# Altium schematic sheet Digital Circuit.SchDoc
size A3
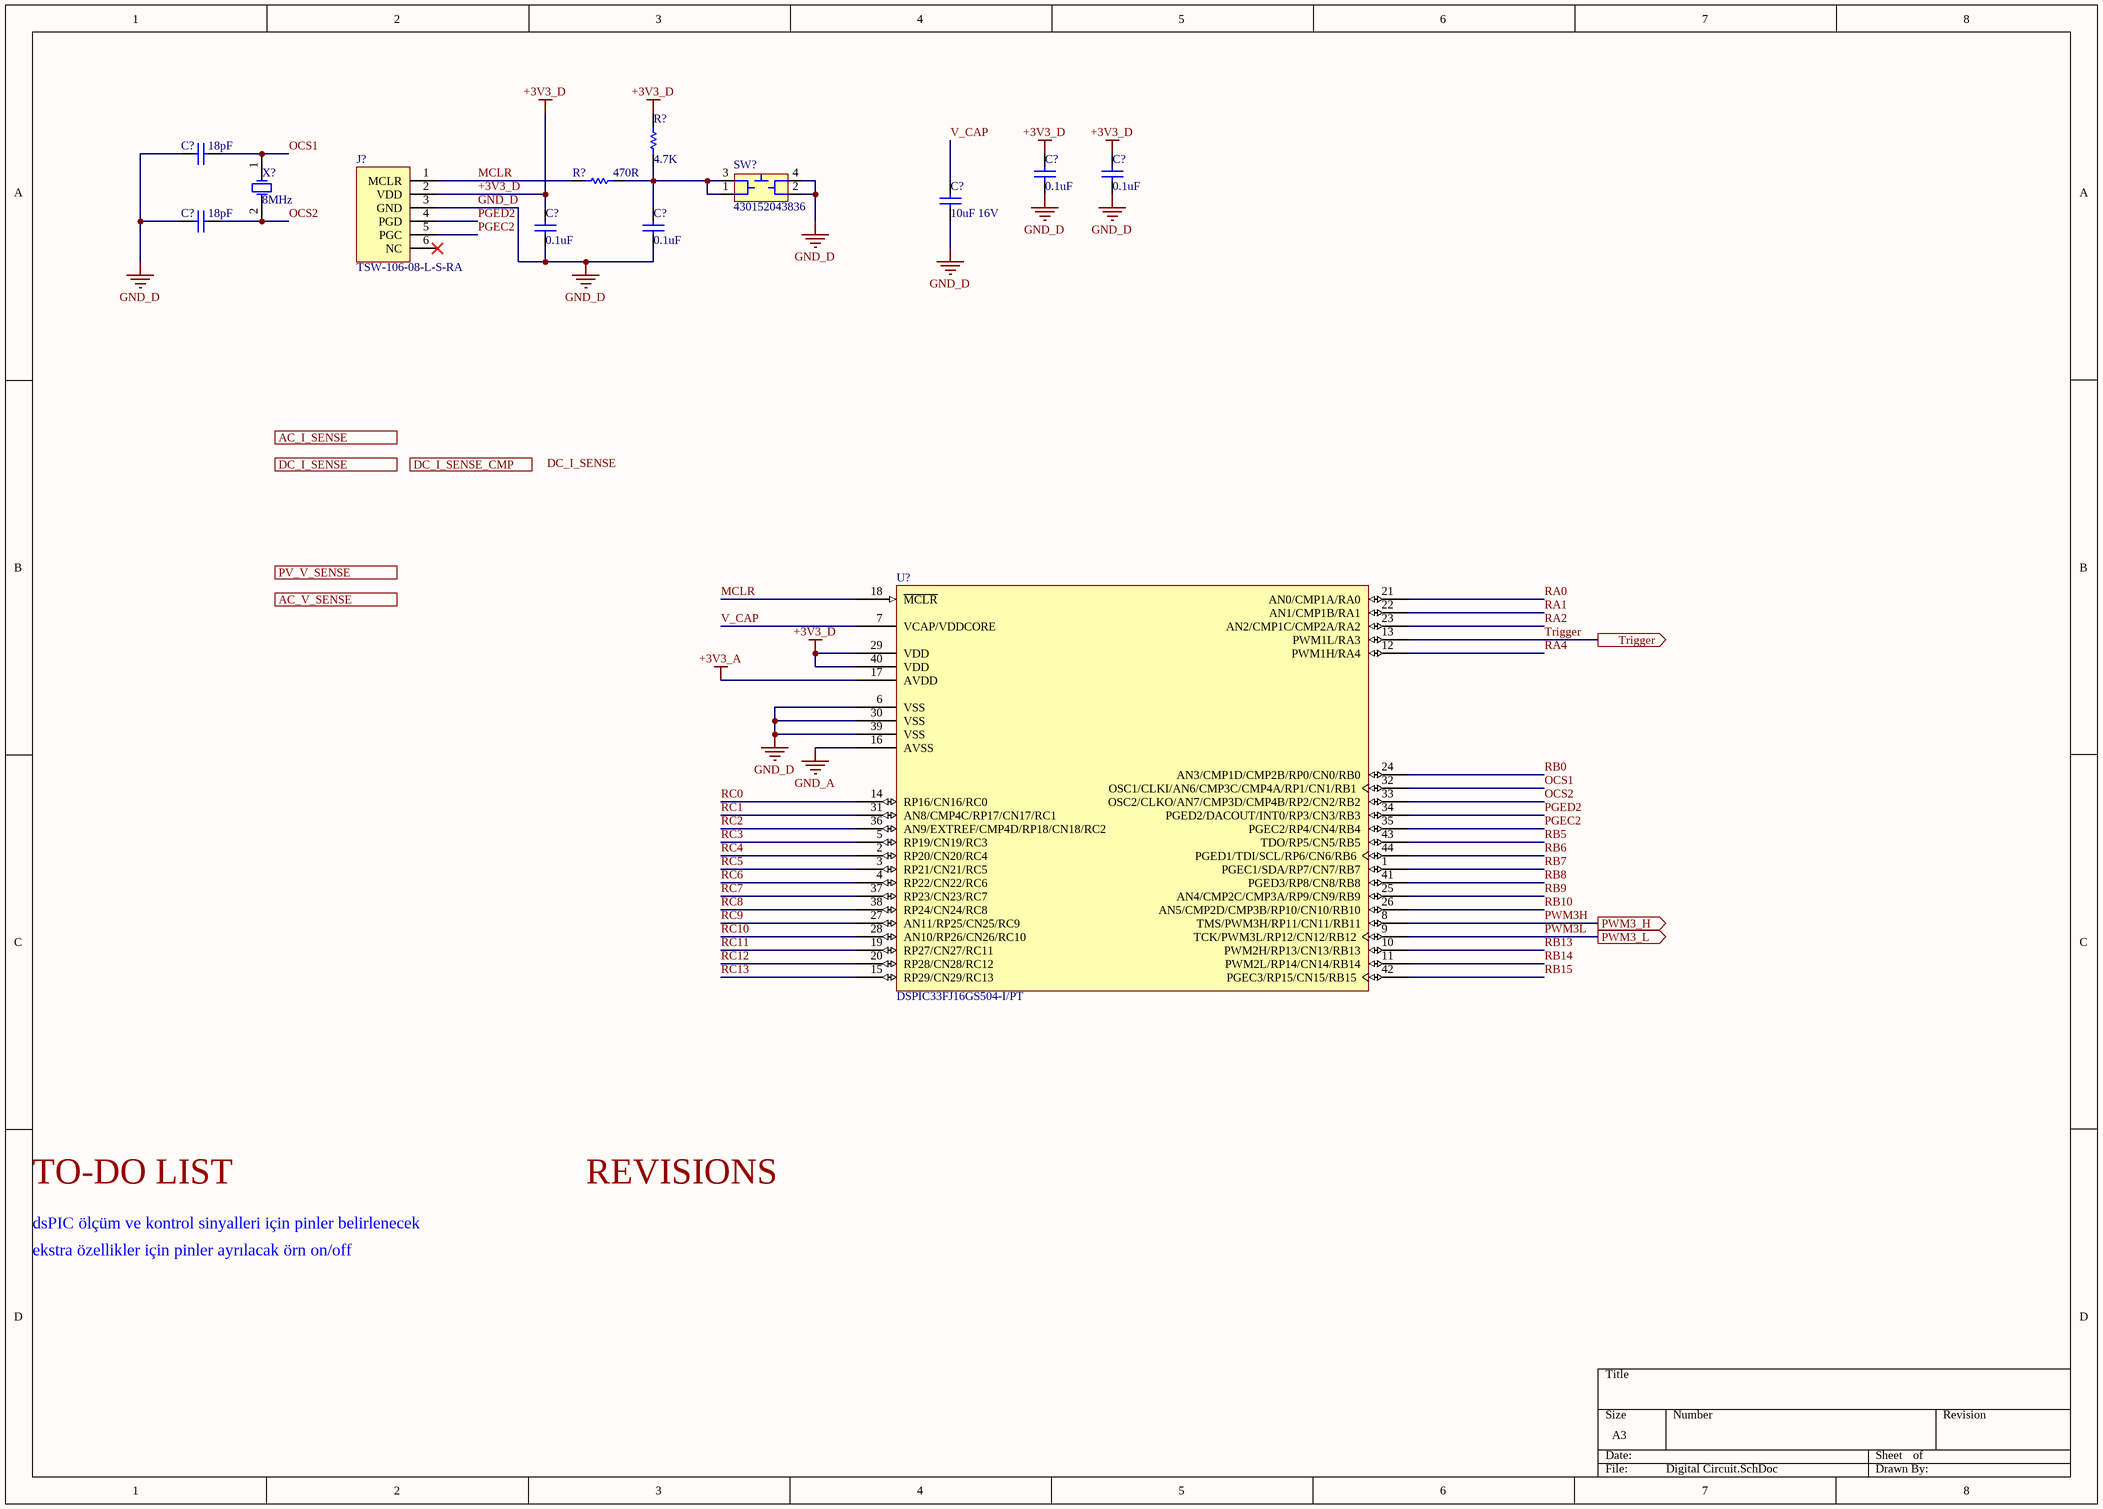
[diagram p0: Digital Circuit.SchDoc]

## Parts
(Parts that share a designator on the sheet are numbered #1, #2 ... from top to bottom, then left to right.)
C?#1  18pF  [1206 CAPACITOR]
C?#2  0.1uF  [1206 CAPACITOR]
C?#3  0.1uF  [1206 CAPACITOR]
C?#4  10uF 16V  [1206 CAPACITOR]
C?#5  18pF  [1206 CAPACITOR]
C?#6  0.1uF  [1206 CAPACITOR]
C?#7  0.1uF  [1206 CAPACITOR]
J?  TSW-106-08-L-S-RA  [1x6 Header 2.54mm]
R?#1  4.7K  [1206 Resistor Footprint]
R?#2  470R  [1206 Resistor Footprint]
SW?  430152043836  [6x6mm Button]
U?  DSPIC33FJ16GS504-I/PT  [dsPIC33F16GS504 Connector]
X?  8MHz  [HC-49/US Crystal Footprint]

## Ports
AC_I_SENSE (in), AC_V_SENSE (in), DC_I_SENSE (in), DC_I_SENSE_CMP (in), PV_V_SENSE (in), PWM3_H (out), PWM3_L (out), Trigger (out)

## Nets
+3V3_A: U?.17(AVDD)
+3V3_D: C?#2.2 C?#3.2 C?#6.2 J?.2(VDD) R?#1.2 U?.29(VDD) U?.40(VDD)
GND_A: U?.16(AVSS)
GND_D: C?#1.1 C?#2.1 C?#3.1 C?#4.1 C?#5.1 C?#6.1 C?#7.1 J?.3(GND) SW?.2 SW?.4 U?.6(VSS) U?.30(VSS) U?.39(VSS)
MCLR: J?.1(MCLR) R?#2.1 U?.18(~{MCLR})
OCS1: C?#1.2 U?.32(OSC1/CLKI/AN6/CMP3C/CMP4A/RP1/CN1/RB1) X?.1(X1)
OCS2: C?#5.2 U?.33(OSC2/CLKO/AN7/CMP3D/CMP4B/RP2/CN2/RB2) X?.2(X2)
PGEC2: J?.5(PGC) U?.35(PGEC2/RP4/CN4/RB4)
PGED2: J?.4(PGD) U?.34(PGED2/DACOUT/INT0/RP3/CN3/RB3)
PWM3H: U?.8(TMS/PWM3H/RP11/CN11/RB11) ; port PWM3_H
PWM3L: U?.9(TCK/PWM3L/RP12/CN12/RB12) ; port PWM3_L
RA0: U?.21(AN0/CMP1A/RA0)
RA1: U?.22(AN1/CMP1B/RA1)
RA2: U?.23(AN2/CMP1C/CMP2A/RA2)
RA4: U?.12(PWM1H/RA4)
RB0: U?.24(AN3/CMP1D/CMP2B/RP0/CN0/RB0)
RB5: U?.43(TDO/RP5/CN5/RB5)
RB6: U?.44(PGED1/TDI/SCL/RP6/CN6/RB6)
RB7: U?.1(PGEC1/SDA/RP7/CN7/RB7)
RB8: U?.41(PGED3/RP8/CN8/RB8)
RB9: U?.25(AN4/CMP2C/CMP3A/RP9/CN9/RB9)
RB10: U?.26(AN5/CMP2D/CMP3B/RP10/CN10/RB10)
RB13: U?.10(PWM2H/RP13/CN13/RB13)
RB14: U?.11(PWM2L/RP14/CN14/RB14)
RB15: U?.42(PGEC3/RP15/CN15/RB15)
RC0: U?.14(RP16/CN16/RC0)
RC1: U?.31(AN8/CMP4C/RP17/CN17/RC1)
RC2: U?.36(AN9/EXTREF/CMP4D/RP18/CN18/RC2)
RC3: U?.5(RP19/CN19/RC3)
RC4: U?.2(RP20/CN20/RC4)
RC5: U?.3(RP21/CN21/RC5)
RC6: U?.4(RP22/CN22/RC6)
RC7: U?.37(RP23/CN23/RC7)
RC8: U?.38(RP24/CN24/RC8)
RC9: U?.27(AN11/RP25/CN25/RC9)
RC10: U?.28(AN10/RP26/CN26/RC10)
RC11: U?.19(RP27/CN27/RC11)
RC12: U?.20(RP28/CN28/RC12)
RC13: U?.15(RP29/CN29/RC13)
Trigger: U?.13(PWM1L/RA3) ; port Trigger
V_CAP: C?#4.2 U?.7(VCAP/VDDCORE)
NetC?#7_2: C?#7.2 R?#1.1 R?#2.2 SW?.1 SW?.3

Not connected (* = marked no-connect by the designer): J? 6(NC)*

## Notes on the sheet
- TO-DO LIST
- REVISIONS
- dsPIC ölçüm ve kontrol sinyalleri için pinler belirlenecek
- ekstra özellikler için pinler ayrılacak örn on/off
- Labels drawn without touching a wire or pin: DC_I_SENSE

## Library data of the parts
C?#1-C?#3 C?#5-C?#7 = Capacitor Non-Polorized: Value: 10uF; Case-EIA: 1206; Tolerance: -20% to +80%; Rated Voltage: 25 V; Case-Metric: 3216; Max Thickness: 1.9 mm; Technology: SMT
C?#4 = Capacitor Non-Polorized: Case-EIA: 1206; Tolerance: -20% to +80%; Rated Voltage: 25 V; Case-Metric: 3216; Value: 10uF; Max Thickness: 1.9 mm; Technology: SMT
J? = 1x6 Header: 0.025" SQ Post Header, Through-hole, Right Angle, -55 to 125 degC, 2.54 mm Pitch, 6-Pin, Male, RoHS; Manufacturer: Samtec; Pitch: 2.54 mm; ComponentLink2URL: http://www.samtec.com/documents/webfiles/pdf/TSW_TH.PDF; ComponentLink3Description: Package Specification; PackageVersion: DM, 8/1988; ComponentLink3URL: http://www.samtec.com/documents/webfiles/cpdf/TSW-XXX-XX-XXX-X-XX-XXX-MKT.pdf; ComponentLink1Description: Manufacturer URL; RoHS: True; ComponentLink2Description: Datasheet; PackageDescription: .025[0.64] SQ. Post Terminal Strip Assembly; Temperature Range: -55 to 125 degC; Orientation: Right Angle; DatasheetVersion: F-214; PartNumber: TSW-106-08-L-S-RA; PackageReference: TSW-106-08-X-S-RA; ComponentLink1URL: http://www.samtec.com; Mounting Technology: Through-hole
R?#1 R?#2 = Resistor
SW? = 6x6 Button: WS-TASV SMD Tact Switch 6X6 mm; Manufacturer: Wuerth Elektronik; NoPins: 04; PartNumber: 430152043836; ComponentLink2URL: http://katalog.we-online.de/em/datasheet/4301x2.pdf; ComponentLink1URL: http://www.we-online.com; ComponentLink2Description: Datasheet; ComponentLink1Description: Manufacturer URL; PackageReference: 430152043836
U? = DSPIC33FJ16GS504-I/PT: High-Performance 16-bit Digital Signal Controller, 16 KB Flash, 2 KB RAM , 44-Pin TQFP, Industrial Temperature; PackageVersion: revBB, Aug-2009; PackageDescription: 44-Lead Plastic Thin Quad Flatpack (PT) - 10x10x1mm Body, 2.00mm [TQFP]; Code_JEDEC: MS-026; PackageReference: TQFP-PT44; DatasheetVersion: revD, Mar-2009
X? = 8MHz Crystal: Low Profile Surface Mount Microprocessor Crystal, 4.096 MHz +/-30 ppm, 180 Ohm, -40 to 85 degC, 2-Pin 11.4 x 4.7 x 3.3 mm SMD, RoHS, Tape and Reel; Manufacturer: Abracon; PartNumber: ABLS2-4.096MHZ-D4Y-T; Operation Mode: Fundamental or 3rd Overtone; Shunt Capacitance: 7 pF Max.; ESR: 180 Ohm; Load Capacitance: 18 pF; Mounting Technology: Surface Mount; PackageDescription: 2-Pin SMD, Body 11.4 x 4.7 mm, Height 3.3 mm; ComponentLink1URL: http://www.abracon.com/; Freq. Stability: +/- 30 ppm; ComponentLink2Description: Datasheet; Operating Temp. Range: -40 to 85 degC; Packing: Tape and Reel; RoHS: TRUE; PackageReference: ABLS2-2; DatasheetVersion: Rev. 03.31.11; Freq. Tolerance: +/- 30 ppm; Frequency: 4.096 MHz; ComponentLink2URL: http://www.abracon.com/Resonators/ABLS2.pdf; ComponentLink1Description: Manufacturer URL